# EAGLE schematic uklad-eagle (EAGLE 6.5.0)
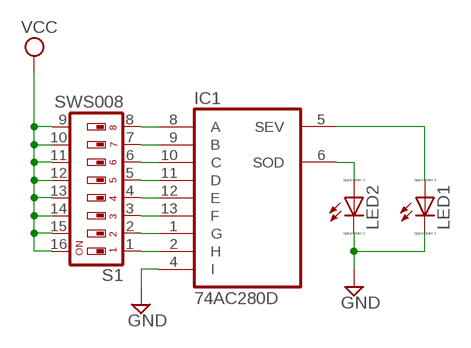
[diagram p0: schematic, sheet 1]

## Parts
IC1  74AC280D  [SO14]
LED1  LED_E  [LED_1206]
LED2  LED_E  [LED_1206]
S1  SWS008  [SMS-008]

## Nets
GND: IC1.4(I) LED1.C LED2.C
N$1: IC1.2(H) S1.1
N$2: IC1.1(G) S1.2
N$3: IC1.13(F) S1.3
N$4: IC1.12(E) S1.4
N$5: IC1.11(D) S1.5
N$6: IC1.10(C) S1.6
N$7: IC1.9(B) S1.7
N$8: IC1.8(A) S1.8
N$11: IC1.6(SOD) LED2.A
N$12: IC1.5(SEV) LED1.A
VCC: S1.9 S1.10 S1.11 S1.12 S1.13 S1.14 S1.15 S1.16

## Power pins joined to a net without a drawn wire
GND: IC1.7(GND)
VCC: IC1.14(VCC)

## Library data of the parts
IC1 = 74xx-eu:74*280: 9-bit odd/even PARITY GENERATOR/CHECKER
LED1 LED2 = eagle-ltspice:LED_E: LED Source: http://www.osram.convergy.de Source: www.luxeon.com Source: www.kingbright.com; SPICEMODEL: NONE; SPICEPREFIX: D; SPICETYPE: diode
S1 = smd-special:SWS008: SMD Dip Switch 8 pol.